# Altium project DS165-1.1-B铵根离子传感器.PrjPcb
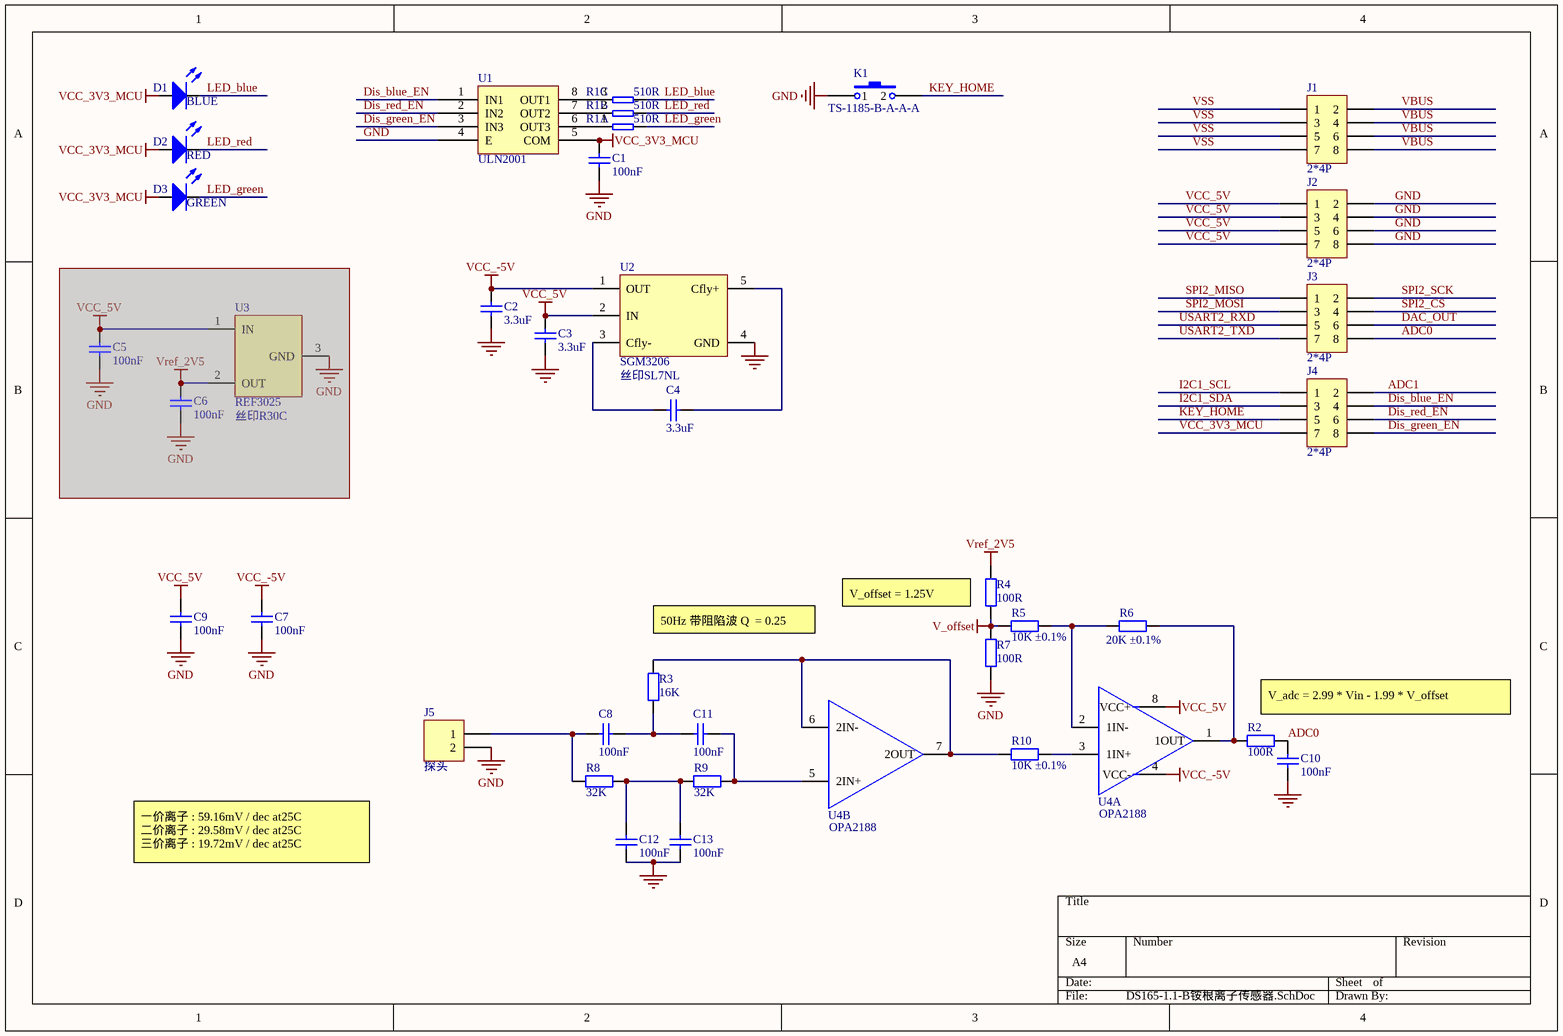
[diagram p0: DS165-1.1-B铵根离子传感器.SchDoc]
1 sheet, 36 parts. Net scope: global (net labels, ports and power ports of the same name join across sheets).
Board file: DS165-1.1-B铵根离子传感器.PcbDoc

## Sheet DS165-1.1-B铵根离子传感器.SchDoc
size A4; SheetNumber: 1; SheetTotal: 1

### Parts
C1  value 100nF  [0603CAP]  (hidden comment: SMDCAP00013)
C2  value 3.3uF  [0603CAP]  (hidden comment: MLCC 3.3uF 50V ±10％ 0603)
C3  value 3.3uF  [0603CAP]  (hidden comment: MLCC 3.3uF 50V ±10％ 0603)
C4  value 3.3uF  [0603CAP]  (hidden comment: MLCC 3.3uF 50V ±10％ 0603)
C5  value 100nF  [0603CAP]  (hidden comment: MLCC 100nF 50V ±10％ 0603)  (masked out: inside a compile mask, not in the netlist)
C6  value 100nF  [0603CAP]  (hidden comment: MLCC 100nF 50V ±10％ 0603)  (masked out: inside a compile mask, not in the netlist)
C7  value 100nF  [0603CAP]  (hidden comment: MLCC 100nF 50V ±10％ 0603)
C8  value 100nF  [0603CAP]  (hidden comment: MLCC 100nF 50V ±10％ 0603)
C9  value 100nF  [0603CAP]  (hidden comment: MLCC 100nF 50V ±10％ 0603)
C10  value 100nF  [0603CAP]  (hidden comment: MLCC 100nF 50V ±10％ 0603)
C11  value 100nF  [0603CAP]  (hidden comment: MLCC 100nF 50V ±10％ 0603)
C12  value 100nF  [0603CAP]  (hidden comment: MLCC 100nF 50V ±10％ 0603)
C13  value 100nF  [0603CAP]  (hidden comment: MLCC 100nF 50V ±10％ 0603)
D1  value BLUE  [LED_0805]  (hidden comment: SMDLED00010)
D2  value RED  [LED_0805]  (hidden comment: SMDLED00003)
D3  value GREEN  [LED_0805]  (hidden comment: Chip 翠绿LED 0805)
J1  value 2*4P  [X1321WVS-2x04J-C40D53]  (hidden comment: X1321WVS-2x04J-C40D53)
J2  value 2*4P  [X1321WVS-2x04J-C40D53]  (hidden comment: X1321WVS-2x04J-C40D53)
J3  value 2*4P  [X1321WVS-2x04J-C40D53]  (hidden comment: X1321WVS-2x04J-C40D53)
J4  value 2*4P  [X1321WVS-2x04J-C40D53]  (hidden comment: X1321WVS-2x04J-C40D53)
J5  value 探头  [SIP2]  (hidden comment: SL000000042)
K1  TS-1185-B-A-A-A  [KEY_TS-1185-x-A-A-A]
R1  value 510R  [0603RES_Pack4]  (hidden comment: SMDRES05003)  (parts A,B,C of 4)
R2  value 100R  [0603RES]  (hidden comment: SMDRES00015)
R3  value 16K  [0603RES]  (hidden comment: Chip 16K 1/16W ±1％ 0603)
R4  value 100R  [0603RES]  (hidden comment: SMDRES00015)
R5  value 10K ±0.1%  [0603RES]  (hidden comment: Chip 10K 1/10W ±0.1％ 0603)
R6  value 20K ±0.1%  [0603RES]  (hidden comment: Chip 20K 1/10W ±0.1％ 0603)
R7  value 100R  [0603RES]  (hidden comment: SMDRES00015)
R8  value 32K  [0603RES]  (hidden comment: Chip 32K 1/16W ±1％ 0603)
R9  value 32K  [0603RES]  (hidden comment: Chip 32K 1/16W ±1％ 0603)
R10  value 10K ±0.1%  [0603RES]  (hidden comment: Chip 10K 1/10W ±0.1％ 0603)
U1  value ULN2001  [SO-8]  (hidden comment: SMDIC000018)
U2  SGM3206  value 丝印SL7NL  [SOT23-5]
U3  REF3025  value 丝印R30C  [SOT23]  (masked out: inside a compile mask, not in the netlist)
U4  OPA2188  [SO-8]  (parts A,B of 2)

### Nets
GND: C1.1 C2.1 C3.1 C7.1 C9.1 C10.1 C12.2 C13.2 J2.2 J2.4 J2.6 J2.8 J5.2 K1.1 R7.1 U1.4(E) U2.4(GND)
V_offset: R4.1 R5.1 R7.2
VCC_3V3_MCU: C1.2 D1.1(A) D2.1(A) D3.1(A) J4.7 U1.5(COM)
VCC_5V: C3.2 C9.2 J2.1 J2.3 J2.5 J2.7 U2.2(IN) U4.8(VCC+)
VCC_-5V: C2.2 C7.2 U2.1(OUT) U4.4(VCC-)
Vref_2V5: R4.2
ADC0: C10.2 J3.8 R2.2
ADC1: J4.2
DAC_OUT: J3.6
Dis_blue_EN: J4.4 U1.1(IN1)
Dis_green_EN: J4.8 U1.3(IN3)
Dis_red_EN: J4.6 U1.2(IN2)
I2C1_SCL: J4.1
I2C1_SDA: J4.3
KEY_HOME: J4.5 K1.2
LED_blue: D1.2(K) R1.6
LED_green: D3.2(K) R1.8
LED_red: D2.2(K) R1.7
SPI2_CS: J3.4
SPI2_MISO: J3.1
SPI2_MOSI: J3.3
SPI2_SCK: J3.2
USART2_RXD: J3.5
USART2_TXD: J3.7
VBUS: J1.2 J1.4 J1.6 J1.8
VSS: J1.1 J1.3 J1.5 J1.7
NetC4_1: C4.1 U2.5(Cfly+)
NetC4_2: C4.2 U2.3(Cfly-)
NetC8_1: C8.1 C11.2 R3.1
NetC8_2: C8.2 J5.1 R8.2
NetC11_1: C11.1 R9.1 U4.5(2IN+)
NetC12_1: C12.1 C13.1 R8.1 R9.2
NetR1_1: R1.1 U1.6(OUT3)
NetR1_2: R1.2 U1.7(OUT2)
NetR1_3: R1.3 U1.8(OUT1)
NetR2_1: R2.1 R6.2 U4.1(1OUT)
NetR3_2: R3.2 R10.1 U4.6(2IN-) U4.7(2OUT)
NetR5_2: R5.2 R6.1 U4.2(1IN-)
NetR10_2: R10.2 U4.3(1IN+)

### Notes on the sheet
- (near R3) 50Hz 带阻陷波 Q  = 0.25
- (near R4) V_offset = 1.25V
- V_adc = 2.99 * Vin - 1.99 * V_offset
- 一价离子 : 59.16mV / dec at25C
  二价离子 : 29.58mV / dec at25C
  三价离子 : 19.72mV / dec at25C

### Library data of the parts
C1 C5-C13 = MLCC 100nF 50V ±10％ 0603: 贴片电容
C2-C4 = MLCC 3.3uF 50V ±10％ 0603: 贴片电容
D1 = Chip 蓝色LED 0805: 贴片LED
D2 = Chip 红色LED 0805: 贴片LED
D3 = Chip 翠绿LED 0805: 贴片LED
J1-J4 = X1321WVS-2x04J-C40D53: 双排针2x4P 立贴 1.27mm
J5 = DIP2 单排直针 1*40P 间距2.54mm 针长11mm 铜: 单排直针
K1 = TS-1185-B-A-A-A: 轻触开关; Value: TS-1185-B-A-A-A
R1 = Chip R*4 510R 1/16W ±5％ 0603: 贴片排阻
R2 R4 R7 = Chip 100R 1/16W ±1％ 0603: 贴片电阻
R3 = Chip 16K 1/16W ±1％ 0603: 贴片电阻
R8 R9 = Chip 32K 1/16W ±1％ 0603: 贴片电阻
U1 = ULN2001 SOP-8: 电机驱动芯片
U2 = SGM3206: SGMICRO(圣邦微) / SGM3206YN5G/TR / SOT-23-5
U3 = REF3025: TI / REF3025AIDBZR / SOT-23
U4 = OPA2188: 精密运放